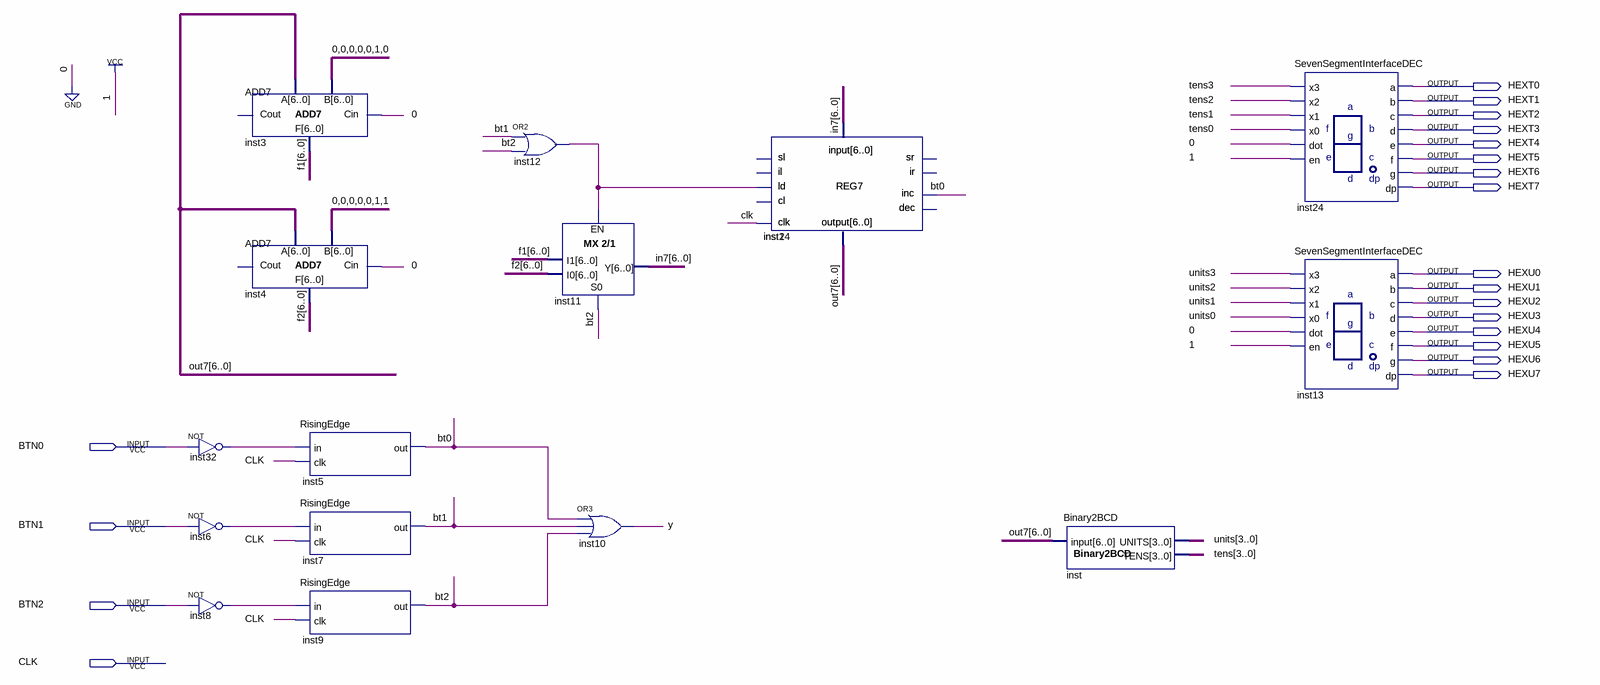
[diagram p0: schematic sheet]
// Quartus schematic Lab3.bdf as structural Verilog: 16 symbols, 20 pins
module Lab3 (
  input  BTN0,
  input  BTN1,
  input  BTN2,
  input  CLK,
  output HEXT0,
  output HEXT1,
  output HEXT2,
  output HEXT3,
  output HEXT4,
  output HEXT5,
  output HEXT6,
  output HEXT7,
  output HEXU0,
  output HEXU1,
  output HEXU2,
  output HEXU3,
  output HEXU4,
  output HEXU5,
  output HEXU6,
  output HEXU7
);

  wire bt0, bt1, bt2, inst6_out, inst8_out, inst12_out, inst32_out, undriven, undriven_2, undriven_3,
       undriven_4, undriven_5, undriven_6, y;
  wire [3:0] tens, units;
  wire [6:0] f1, f2, in7, out7;

  ADD7 inst3 (.Cin(1'b0), .A(out7), .B(7'b0000010), .F(f1));  // open: Cout
  ADD7 inst4 (.Cin(1'b0), .A(out7), .B(7'b0000011), .F(f2));  // open: Cout
  not inst32 (inst32_out, BTN0);
  not inst6 (inst6_out, BTN1);
  not inst8 (inst8_out, BTN2);
  RisingEdge inst5 (.clk(CLK), .\input (inst32_out), .\output (bt0));
  RisingEdge inst7 (.clk(CLK), .\input (inst6_out), .\output (bt1));
  RisingEdge inst9 (.clk(CLK), .\input (inst8_out), .\output (bt2));
  or inst12 (inst12_out, bt1, bt2);
  MX2_1 inst11 (.S0(bt2), .EN(inst12_out), .I0(f2), .I1(f1), .Y(in7));
  or inst10 (y, bt0, bt1, bt2);
  REG7 inst2 (
    .clk(CLK), .ld(inst12_out), .\input (in7), .sr(undriven_4), .ir(undriven_5), .il(undriven_2), .inc(bt0),
    .dec(undriven_6), .cl(undriven_3), .sl(undriven), .\output (out7));
  REG7 inst14 (
    .clk(CLK), .ld(inst12_out), .\input (in7), .sr(undriven_4), .ir(undriven_5), .il(undriven_2), .inc(bt0),
    .dec(undriven_6), .cl(undriven_3), .sl(undriven), .\output (out7));
  Binary2BCD inst (.binary_input(out7), .bcd_units(units), .bcd_tens(tens));
  SevenSegmentInterfaceDEC inst24 (
    .x3(tens[3]), .x2(tens[2]), .x1(tens[1]), .x0(tens[0]), .dot(1'b0), .en(1'b1), .a(HEXT0), .b(HEXT1),
    .c(HEXT2), .d(HEXT3), .e(HEXT4), .f(HEXT5), .g(HEXT6), .dp(HEXT7));
  SevenSegmentInterfaceDEC inst13 (
    .x3(units[3]), .x2(units[2]), .x1(units[1]), .x0(units[0]), .dot(1'b0), .en(1'b1), .a(HEXU0), .b(HEXU1),
    .c(HEXU2), .d(HEXU3), .e(HEXU4), .f(HEXU5), .g(HEXU6), .dp(HEXU7));
endmodule
